# Altium schematic sheet LCD.SchDoc
size A
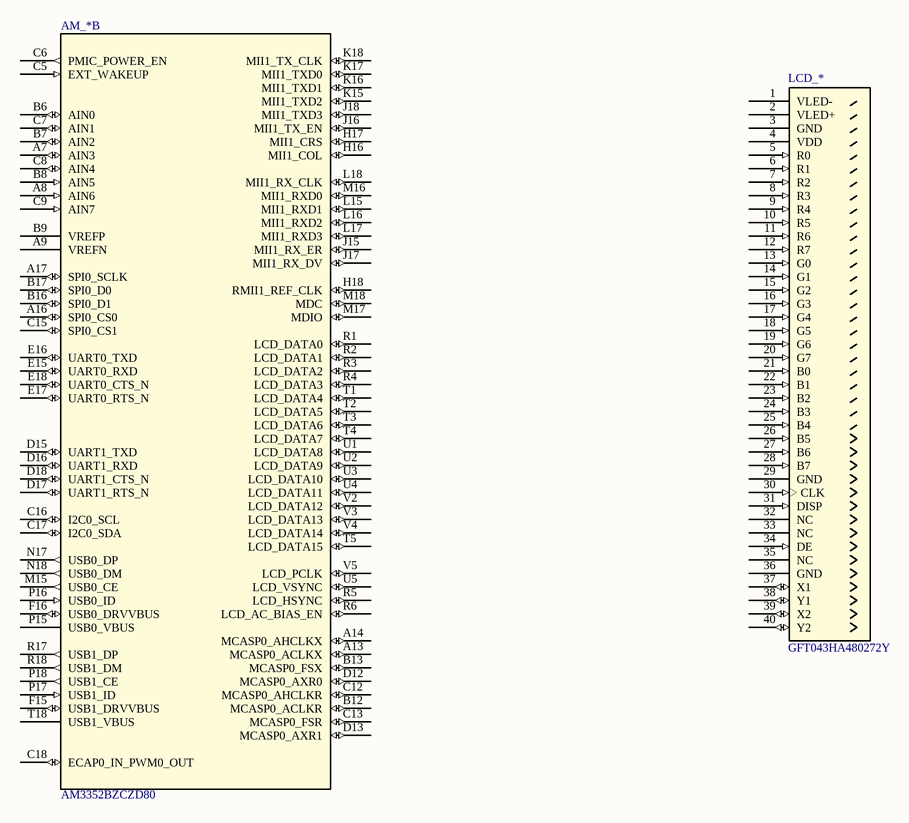
[diagram p0: LCD.SchDoc]

## Parts
AM_*  AM3352BZCZD80  [BGA324C80P18X18_800X1508X1508]  (part B of 4)
LCD_*  GFT043HA480272Y

## Nets

Not connected (* = marked no-connect by the designer): AM_* A7(AIN3) A8(AIN6) A9(VREFN) A13(MCASP0_ACLKX) A14(MCASP0_AHCLKX) A16(SPI0_CS0) A17(SPI0_SCLK) B6(AIN0) B7(AIN2) B8(AIN5) B9(VREFP) B12(MCASP0_ACLKR) B13(MCASP0_FSX) B16(SPI0_D1) B17(SPI0_D0) C5(EXT_WAKEUP) C6(PMIC_POWER_EN) C7(AIN1) C8(AIN4) C9(AIN7) C12(MCASP0_AHCLKR) C13(MCASP0_FSR) C15(SPI0_CS1) C16(I2C0_SCL) C17(I2C0_SDA) C18(ECAP0_IN_PWM0_OUT) D12(MCASP0_AXR0) D13(MCASP0_AXR1) D15(UART1_TXD) D16(UART1_RXD) D17(UART1_RTS_N) D18(UART1_CTS_N) E15(UART0_RXD) E16(UART0_TXD) E17(UART0_RTS_N) E18(UART0_CTS_N) F15(USB1_DRVVBUS) F16(USB0_DRVVBUS) H16(MII1_COL) H17(MII1_CRS) H18(RMII1_REF_CLK) J15(MII1_RX_ER) J16(MII1_TX_EN) J17(MII1_RX_DV) J18(MII1_TXD3) K15(MII1_TXD2) K16(MII1_TXD1) K17(MII1_TXD0) K18(MII1_TX_CLK) L15(MII1_RXD1) L16(MII1_RXD2) L17(MII1_RXD3) L18(MII1_RX_CLK) M15(USB0_CE) M16(MII1_RXD0) M17(MDIO) M18(MDC) N17(USB0_DP) N18(USB0_DM) P15(USB0_VBUS) P16(USB0_ID) P17(USB1_ID) P18(USB1_CE) R1(LCD_DATA0) R2(LCD_DATA1) R3(LCD_DATA2) R4(LCD_DATA3) R5(LCD_HSYNC) R6(LCD_AC_BIAS_EN) R17(USB1_DP) R18(USB1_DM) T1(LCD_DATA4) T2(LCD_DATA5) T3(LCD_DATA6) T4(LCD_DATA7) T5(LCD_DATA15) T18(USB1_VBUS) U1(LCD_DATA8) U2(LCD_DATA9) U3(LCD_DATA10) U4(LCD_DATA11) U5(LCD_VSYNC) V2(LCD_DATA12) V3(LCD_DATA13) V4(LCD_DATA14) V5(LCD_PCLK); LCD_* 1(VLED-) 2(VLED+) 3(GND) 4(VDD) 5(R0) 6(R1) 7(R2) 8(R3) 9(R4) 10(R5) 11(R6) 12(R7) 13(G0) 14(G1) 15(G2) 16(G3) 17(G4) 18(G5) 19(G6) 20(G7) 21(B0) 22(B1) 23(B2) 24(B3) 25(B4) 26(B5) 27(B6) 28(B7) 29(GND) 30(CLK) 31(DISP) 32(NC) 33(NC) 34(DE) 35(NC) 36(GND) 37(X1) 38(Y1) 39(X2) 40(Y2)

## Library data of the parts
AM_* = AM3352BZCZD80: Microprocesseur ARM; Manufacturer: Texas Instruments; Fabricant: Texas Instrument; Fournisseur: Farnell; RefFabricant: AM3352BZCZ100; RefFournisseur: 2494119; PartNumber: AM3352BZCZD80; RefDes: RefDes; TYPE: TYPE; Value: Value
LCD_* = GFT043HA480272Y: Connecteur LCD & Touch screen; Fabricant: TE Connectivity; Fournisseur: Farnell; RefFabricant: 4-1734592-0; RefFournisseur: 1816399